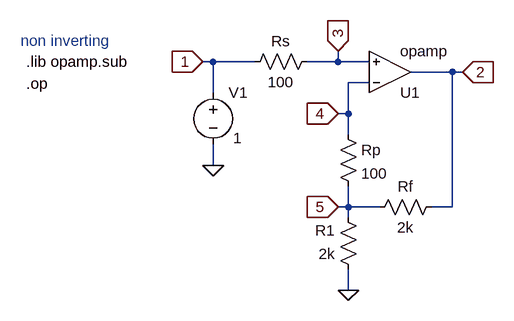
[diagram p0: schematic non-inverting.asc]
non-inverting.asc, the LTspice schematic file:
Version 4
SHEET 1 880 680
WIRE 96 80 80 80
WIRE 160 80 96 80
WIRE 288 80 288 64
WIRE 288 80 240 80
WIRE 336 80 288 80
WIRE 464 96 400 96
WIRE 480 96 464 96
WIRE 336 112 304 112
WIRE 96 128 96 80
WIRE 304 160 304 112
WIRE 304 160 288 160
WIRE 304 192 304 160
WIRE 96 240 96 208
WIRE 304 304 304 272
WIRE 304 304 288 304
WIRE 352 304 304 304
WIRE 464 304 464 96
WIRE 464 304 432 304
WIRE 304 320 304 304
WIRE 304 432 304 400
FLAG 304 432 0
FLAG 96 240 0
FLAG 80 80 1
IOPIN 80 80 In
FLAG 480 96 2
IOPIN 480 96 In
FLAG 288 160 4
IOPIN 288 160 In
FLAG 288 64 3
IOPIN 288 64 In
FLAG 288 304 5
IOPIN 288 304 In
SYMBOL voltage 96 112 R0
WINDOW 123 29 90 Left 2
WINDOW 39 0 0 Left 0
WINDOW 3 31 86 Left 2
SYMATTR InstName V1
SYMATTR Value 1
SYMBOL OpAmps\\opamp 368 160 M180
SYMATTR InstName U1
SYMBOL res 256 64 R90
WINDOW 0 0 56 VBottom 2
WINDOW 3 32 56 VTop 2
SYMATTR InstName Rs
SYMATTR Value 100
SYMBOL res 320 416 R180
WINDOW 0 36 76 Left 2
WINDOW 3 36 40 Left 2
SYMATTR InstName R1
SYMATTR Value 2k
SYMBOL res 448 288 R90
WINDOW 0 0 56 VBottom 2
WINDOW 3 32 56 VTop 2
SYMATTR InstName Rf
SYMATTR Value 2k
SYMBOL res 288 176 R0
SYMATTR InstName Rp
SYMATTR Value 100
TEXT -192 80 Left 2 !.lib opamp.sub
TEXT -192 114 Left 2 !.op
TEXT -200 48 Left 2 ;non inverting

The netlist it stands for:
* non-inverting.asc
V1 1 0 1
XU1 4 3 2 opamp Aol=100K GBW=10Meg  ; pins invin noninvin out
Rs 3 1 100
R1 0 5 2k
Rf 2 5 2k
Rp 4 5 100
.lib opamp.sub
.op
* non inverting
.backanno
.end